# Altium project Motor Driver Board 2019-2020.PrjPcb (part 2 of 3)

## Sheet MCU and Digital Interfaces.SchDoc: MCU and Digital Interfaces
size B; CompanyName: Uoe Racing; Organization: UOE Racing; Address1: University of Ottawa; Address2: Camry M; Address3: &; Address4: Nick M; DocumentNumber: 2020; Revision: A; SheetNumber: 2; SheetTotal: 4
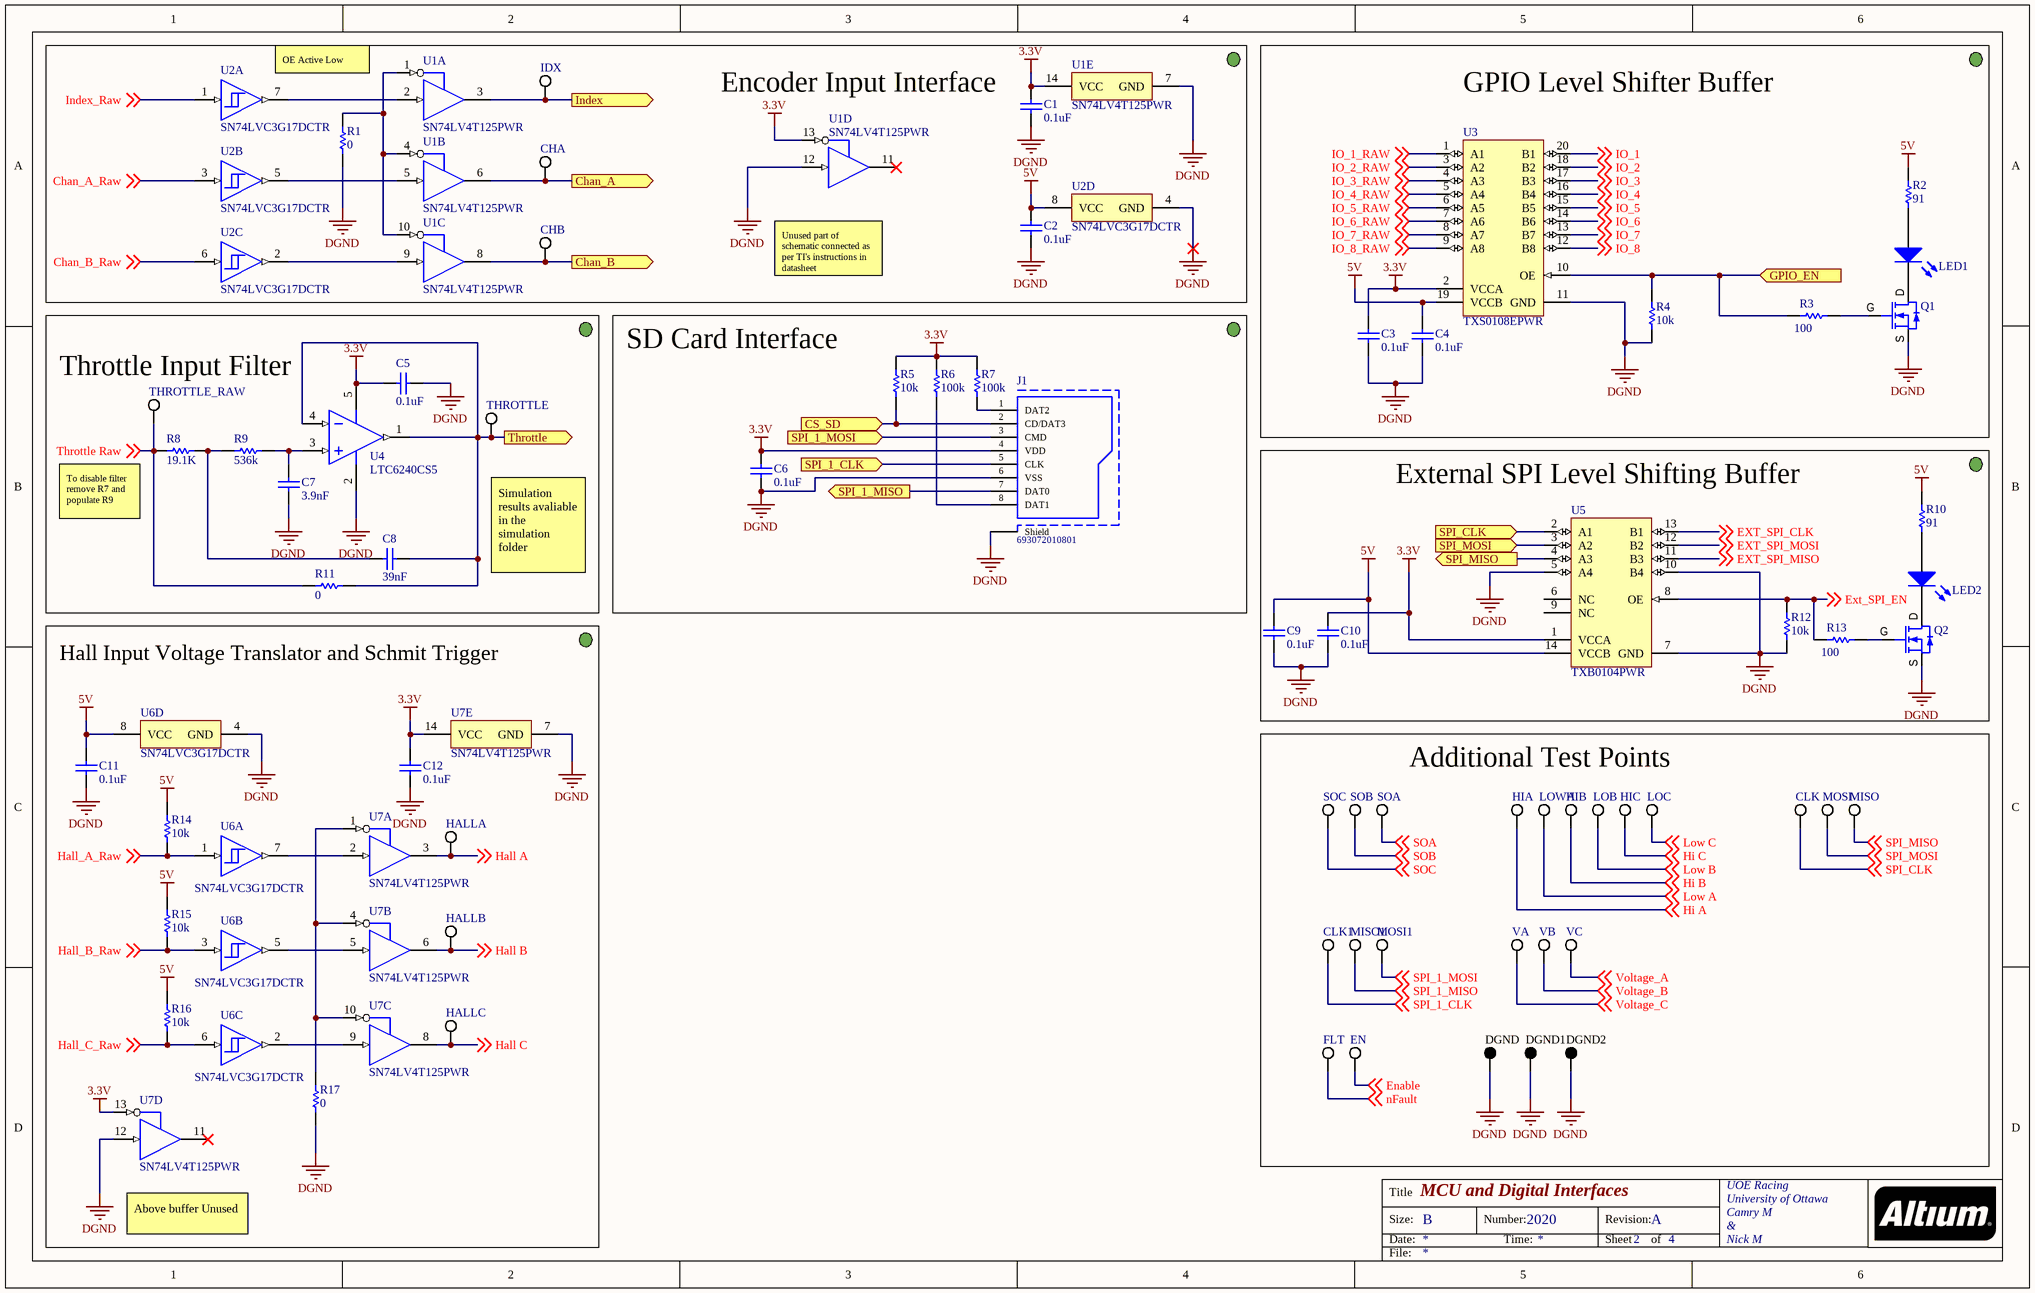
[diagram p1: MCU and Digital Interfaces.SchDoc]

### Parts
C1  0.1uF  [CAPC1608X05L]
C2  0.1uF  [CAPC1608X05L]
C3  0.1uF  [CAPC1608X05L]
C4  0.1uF  [CAPC1608X05L]
C5  0.1uF  [CAPC1608X05L]
C6  0.1uF  [CAPC1608X05L]
C7  3.9nF  [CAPC1608X05L]
C8  39nF  [CAPC1608X05L]
C9  0.1uF  [CAPC1608X05L]
C10  0.1uF  [CAPC1608X05L]
C11  0.1uF  [CAPC1608X05L]
C12  0.1uF  [CAPC1608X05L]
CHA  5015  [KSTN-5015_V]  (value not drawn)
CHB  5015  [KSTN-5015_V]  (value not drawn)
CLK  5015  [KSTN-5015_V]  (value not drawn)
CLK1  5015  [KSTN-5015_V]  (value not drawn)
DGND  5011  [KSTN-5011_V]  (value not drawn)
DGND1  5011  [KSTN-5011_V]  (value not drawn)
DGND2  5011  [KSTN-5011_V]  (value not drawn)
EN  5015  [KSTN-5015_V]  (value not drawn)
FLT  5015  [KSTN-5015_V]  (value not drawn)
HALLA  5015  [KSTN-5015_V]  (value not drawn)
HALLB  5015  [KSTN-5015_V]  (value not drawn)
HALLC  5015  [KSTN-5015_V]  (value not drawn)
HIA  5015  [KSTN-5015_V]  (value not drawn)
HIB  5015  [KSTN-5015_V]  (value not drawn)
HIC  5015  [KSTN-5015_V]  (value not drawn)
IDX  5015  [KSTN-5015_V]  (value not drawn)
J1  693072010801  [693072010801]
LED1  150080GS75000  [0805_A]  (value not drawn)
LED2  150080GS75000  [0805_A]  (value not drawn)
LOB  5015  [KSTN-5015_V]  (value not drawn)
LOC  5015  [KSTN-5015_V]  (value not drawn)
LOWA  5015  [KSTN-5015_V]  (value not drawn)
MISO  5015  [KSTN-5015_V]  (value not drawn)
MISO1  5015  [KSTN-5015_V]  (value not drawn)
MOSI  5015  [KSTN-5015_V]  (value not drawn)
MOSI1  5015  [KSTN-5015_V]  (value not drawn)
Q1  DMN1019USN-7  [SOT95P285X140-3N]  (value not drawn)
Q2  DMN1019USN-7  [SOT95P285X140-3N]  (value not drawn)
R1  0  [RESC3116X65X40NL10T20]
R2  91  [RESC1608X50X30NL20T20]
R3  100  [CAPC1608X05L]
R4  10k  [CAPC1608X05L]
R5  10k  [CAPC1608X05L]
R6  100k  [CAPC1608X05L]
R7  100k  [CAPC1608X05L]
R8  19.1K  [CAPC1608X05L]
R9  536k  [CAPC1608X05L]
R10  91  [RESC1608X50X30NL20T20]
R11  0  [RESC3116X65X40NL10T20]
R12  10k  [CAPC1608X05L]
R13  100  [CAPC1608X05L]
R14  10k  [CAPC1608X05L]
R15  10k  [CAPC1608X05L]
R16  10k  [CAPC1608X05L]
R17  0  [RESC3116X65X40NL10T20]
SOA  5015  [KSTN-5015_V]  (value not drawn)
SOB  5015  [KSTN-5015_V]  (value not drawn)
SOC  5015  [KSTN-5015_V]  (value not drawn)
THROTTLE  5015  [KSTN-5015_V]  (value not drawn)
THROTTLE_RAW  5015  [KSTN-5015_V]  (value not drawn)
U1  SN74LV4T125PWR  [PW0014A_N]  (parts A,B,C,D,E of 5)
U2  SN74LVC3G17DCTR  [DCT0008A_M]  (parts A,B,C,D of 4)
U3  TXS0108EPWR  [PW0020A_M]
U4  LTC6240CS5  [LT-S5-5-TSOT-23_L]
U5  TXB0104PWR  [PW0014A_N]
U6  SN74LVC3G17DCTR  [DCT0008A_M]  (parts A,B,C,D of 4)
U7  SN74LV4T125PWR  [PW0014A_N]  (parts A,B,C,D,E of 5)
VA  5015  [KSTN-5015_V]  (value not drawn)
VB  5015  [KSTN-5015_V]  (value not drawn)
VC  5015  [KSTN-5015_V]  (value not drawn)

### Blocks framed on the sheet
Encoder Input Interface: C1 C2 CHA CHB IDX R1 U1 U2
GPIO Level Shifter Buffer: C3 C4 LED1 Q1 R2-R4 U3
Throttle Input Filter: C5 C7 C8 R8 R9 R11 THROTTLE THROTTLE_RAW U4
SD Card Interface: C6 J1 R5-R7
External SPI Level Shifting Buffer: C9 C10 LED2 Q2 R10 R12 R13 U5
Hall Input Voltage Translator and Schmit Trigger: C11 C12 HALLA HALLB HALLC R14-R17 U6 U7
Additional Test Points: CLK CLK1 DGND DGND1 DGND2 EN FLT HIA HIB HIC LOB LOC LOWA MISO MISO1 MOSI MOSI1 SOA SOB SOC VA VB VC

### Ports
Chan_A (out), Chan_B (out), CS_SD (in), GPIO_EN (in), Index (out), SPI_1_CLK (in), SPI_1_MISO (out), SPI_1_MOSI (in), SPI_CLK (in), SPI_MISO (out), SPI_MOSI (in), Throttle (out)

### Nets
3.3V: C1.2 C3.2 C5.1 C6.2 C10.2 C12.2 J1.4(VDD) R5.2 R6.2 R7.2 U1.13(4~{OE}) U1.14(VCC) U3.2(VCCA) U4.5(V+) U5.1(VCCA) U7.13(4~{OE}) U7.14(VCC)
5V: C2.2 C4.2 C9.2 C11.2 R2.2 R10.2 R14.2 R15.2 R16.2 U2.8(VCC) U3.19(VCCB) U5.14(VCCB) U6.8(VCC)
DGND: C1.1 C2.1 C3.1 C4.1 C5.2 C6.1 C7.1 C9.1 C10.1 C11.1 C12.1 DGND.1 DGND1.1 DGND2.1 J1.6(VSS) J1.Shield Q1.S Q2.S R1.1 R4.1 R12.1 R17.1 U1.7(GND) U1.12(4A) U2.4(GND) U3.11(GND) U4.2(V-) U5.5(A4) U5.7(GND) U5.10(B4) U6.4(GND) U7.7(GND) U7.12(4A)  [project net AGND]
Chan_A_Raw: U2.3(2A) ; off-sheet Chan_A_Raw
Chan_B_Raw: U2.6(3A) ; off-sheet Chan_B_Raw
Enable: EN.1 ; off-sheet Enable
EXT_SPI_CLK: U5.13(B1) ; off-sheet EXT_SPI_CLK
Ext_SPI_EN: R12.2 R13.1 U5.8(OE) ; off-sheet Ext_SPI_EN
EXT_SPI_MISO: U5.11(B3) ; off-sheet EXT_SPI_MISO
EXT_SPI_MOSI: U5.12(B2) ; off-sheet EXT_SPI_MOSI
Hall A: HALLA.1 U7.3(1Y) ; off-sheet Hall A
Hall B: HALLB.1 U7.6(2Y) ; off-sheet Hall B
Hall C: HALLC.1 U7.8(3Y) ; off-sheet Hall C
Hall_A_Raw: R14.1 U6.1(1A) ; off-sheet Hall_A_Raw
Hall_B_Raw: R15.1 U6.3(2A) ; off-sheet Hall_B_Raw
Hall_C_Raw: R16.1 U6.6(3A) ; off-sheet Hall_C_Raw
Hi A: HIA.1 ; off-sheet Hi A
Hi B: HIB.1 ; off-sheet Hi B
Hi C: HIC.1 ; off-sheet Hi C
Index_Raw: U2.1(1A) ; off-sheet Index_Raw
IO_1: U3.20(B1) ; off-sheet IO_1
IO_1_RAW: U3.1(A1) ; off-sheet IO_1_RAW
IO_2: U3.18(B2) ; off-sheet IO_2
IO_2_RAW: U3.3(A2) ; off-sheet IO_2_RAW
IO_3: U3.17(B3) ; off-sheet IO_3
IO_3_RAW: U3.4(A3) ; off-sheet IO_3_RAW
IO_4: U3.16(B4) ; off-sheet IO_4
IO_4_RAW: U3.5(A4) ; off-sheet IO_4_RAW
IO_5: U3.15(B5) ; off-sheet IO_5
IO_5_RAW: U3.6(A5) ; off-sheet IO_5_RAW
IO_6: U3.14(B6) ; off-sheet IO_6
IO_6_RAW: U3.7(A6) ; off-sheet IO_6_RAW
IO_7: U3.13(B7) ; off-sheet IO_7
IO_7_RAW: U3.8(A7) ; off-sheet IO_7_RAW
IO_8: U3.12(B8) ; off-sheet IO_8
IO_8_RAW: U3.9(A8) ; off-sheet IO_8_RAW
Low A: LOWA.1 ; off-sheet Low A
Low B: LOB.1 ; off-sheet Low B
Low C: LOC.1 ; off-sheet Low C
nFault: FLT.1 ; off-sheet nFault
SOA: SOA.1 ; off-sheet SOA
SOB: SOB.1 ; off-sheet SOB
SOC: SOC.1 ; off-sheet SOC
SPI_1_CLK: CLK1.1 ; off-sheet SPI_1_CLK
SPI_1_MISO: MISO1.1 ; off-sheet SPI_1_MISO
SPI_1_MOSI: MOSI1.1 ; off-sheet SPI_1_MOSI
SPI_CLK: CLK.1 ; off-sheet SPI_CLK
SPI_MISO: MISO.1 ; off-sheet SPI_MISO
SPI_MOSI: MOSI.1 ; off-sheet SPI_MOSI
Throttle Raw: R8.1 R11.1 THROTTLE_RAW.1 ; off-sheet Throttle Raw
Voltage_A: VC.1 ; off-sheet Voltage_A
Voltage_B: VB.1 ; off-sheet Voltage_B
Voltage_C: VA.1 ; off-sheet Voltage_C
NetC7_2: C7.2 R9.2 U4.3(+IN)
NetC8_1: C8.1 R8.2 R9.1
NetC8_2: C8.2 R11.2 THROTTLE.1 U4.1(OUT) U4.4(-IN) ; port Throttle
NetCHA_1: CHA.1 U1.6(2Y) ; port Chan_A
NetCHB_1: CHB.1 U1.8(3Y) ; port Chan_B
NetIDX_1: IDX.1 U1.3(1Y) ; port Index
NetJ1_1: J1.1(DAT2) R7.1
NetJ1_2: J1.2(CD/DAT3) R5.1 ; port CS_SD
NetJ1_3: J1.3(CMD) ; port SPI_1_MOSI
NetJ1_5: J1.5(CLK) ; port SPI_1_CLK
NetJ1_7: J1.7(DAT0) ; port SPI_1_MISO
NetJ1_8: J1.8(DAT1) R6.1
NetLED1_1: LED1.1(K) Q1.D
NetLED1_2: LED1.2(A) R2.1
NetLED2_1: LED2.1(K) Q2.D
NetLED2_2: LED2.2(A) R10.1
NetQ1_G: Q1.G R3.2
NetQ2_G: Q2.G R13.2
NetR1_2: R1.2 U1.1(1~{OE}) U1.4(2~{OE}) U1.10(3~{OE})
NetR3_1: R3.1 R4.2 U3.10(OE) ; port GPIO_EN
NetR17_2: R17.2 U7.1(1~{OE}) U7.4(2~{OE}) U7.10(3~{OE})
NetU1_2: U1.2(1A) U2.7(1Y)
NetU1_5: U1.5(2A) U2.5(2Y)
NetU1_9: U1.9(3A) U2.2(3Y)
NetU5_2: U5.2(A1) ; port SPI_CLK
NetU5_3: U5.3(A2) ; port SPI_MOSI
NetU5_4: U5.4(A3) ; port SPI_MISO
NetU6_2: U6.2(3Y) U7.9(3A)
NetU6_5: U6.5(2Y) U7.5(2A)
NetU6_7: U6.7(1Y) U7.2(1A)

Not connected (* = marked no-connect by the designer): U1 11(4Y)*; U5 6(NC) 9(NC); U7 11(4Y)*

### Notes on the sheet
- (near U2) OE Active Low
- Unused part of schematic connected as per TI's instructions in datasheet
- (near R8) To disable filter remove R7 and populate R9
- Simulation results avaliable in the simulation folder
- Above buffer Unused
- Title
- Size:
- Date:
- B
- Number:
- Time:
- Revision:
- Sheet
- of
- File:

### Library data of the parts
C1-C6 C9-C12 = CC0603JRX7R9BB104: Cap Ceramic 0.1uF 50V X7R 5% SMD 0603 125C Paper T/R; Manufacturer: Yageo; Capacitance: 100nF; Supplier 1: Digi-Key; Manufacturer Part Number: CC0603JRX7R9BB104; Stock 1: 40000; Pricing 1: 1=0.17, 10=0.12, 100=0.0562, 500=0.03942, 1000=0.03263 (USD); Mount: Surface Mount; Case/Package: 0603; Number of Pins: 2; Weight: 7.1E-05oz; Case Code (Imperial): 0603; Case Code (Metric): 1608; Min Operating Temperature: -55°C; Max Operating Temperature: 125°C; Tolerance: 5%; Dielectric: X7R; Voltage Rating: 50V; Packaging: Tape and Reel; Voltage Rating (DC): 50V; Termination: SMD/SMT; Composition: Ceramic; Length: 1.6mm; Height: 0.8mm; Width: 0.031inch; Thickness: 0.035inch; Depth: 0.8mm; Radiation Hardening: No; Lead Free: Lead Free; Halogen Free: Halogen Free; ComponentLink1URL: http://www.yageo.com/documents/recent/UPY-GPHC_X7R_6.3V-to-50V_8.pdf; ComponentLink1Description: http://www.yageo.com/documents/recent/UPY-GPHC_X7R_6.3V-to-50V_8.pdf
  C1 C2: ClassName: Encoder
  C5: ClassName: Throttle
C7 = C0603C392J5RACTU: Multilayer Ceramic Capacitors MLCC - SMD/SMT 50volts 3900pF X7R 5%; Manufacturer 1: KEMET; Voltage Rating (DC): 50V; Dissipation Factor: 2.5%; Supplier 1: Digi-Key; Manufacturer Part Number 1: C0603C392J5RACTU; Stock 1: 9639; Pricing 1: 1=0.40000, 10=0.28100, 100=0.16840, 500=0.12628, 1000=0.10663 (USD); RoHS: Yes; Mount: Surface Mount; Case/Package: 0603; Dielectric Material: Ceramic; Case Code (Metric): 1608; Case Code (Imperial): 0603; Min Operating Temperature: -55°C; Max Operating Temperature: 125°C; Capacitance: 3.9nF; Tolerance: 5%; Packaging: Tape and Reel; Dielectric: X7R; Voltage Rating: 50V; Package Quantity: 1; Termination: SMD/SMT; Length: 1.6mm; Height: 0.8mm; Depth: 0.8mm; Width: 0.031inch; Thickness: 0.034inch; Lead Pitch: 0.7mm; REACH SVHC: No SVHC; ComponentLink1URL: http://components.arrow.com/part/dataview/2089105S5980753N7429?src-supplier=Arrow; ComponentLink1Description: http://components.arrow.com/part/dataview/2089105S5980753N7429?src-supplier=Arrow; ComponentLink2URL: http://www.mouser.com/ds/2/212/KEM_C1002_X7R_SMD-1102033.pdf?src-supplier=Mouser; ComponentLink2Description: http://www.mouser.com/ds/2/212/KEM_C1002_X7R_SMD-1102033.pdf?src-supplier=Mouser; ComponentLink3URL: https://search.kemet.com/component-edge/download/datasheet/C0603C392J5RACTU.pdf?src-supplier=Digi-Key; ComponentLink3Description: https://search.kemet.com/component-edge/download/datasheet/C0603C392J5RACTU.pdf?src-supplier=Digi-Key; ComponentLink4URL: https://api.kemet.com/component-edge/download/datasheet/C0603C392J5RACTU.pdf?src-supplier=Digi-Key; ComponentLink4Description: https://api.kemet.com/component-edge/download/datasheet/C0603C392J5RACTU.pdf?src-supplier=Digi-Key; ClassName: Throttle
C8 = 06035C393JAT2A: Ceramic Capacitor 0.039uf 50v, X7r, 5%, 0603, Full Reel; Manufacturer 1: Kyocera AVX; Dissipation Factor: 2.5%; Supplier 1: Digi-Key; Manufacturer Part Number 1: 06035C393JAT2A; Stock 1: 3075; Pricing 1: 1=0.37000, 10=0.25900, 100=0.15560, 500=0.11670, 1000=0.09854 (USD); RoHS: Yes; Mount: Surface Mount; Case/Package: 0603; Number of Pins: 2; Case Code (Imperial): 0603; Case Code (Metric): 1608; Min Operating Temperature: -55°C; Max Operating Temperature: 125°C; Capacitance: 39nF; Package Quantity: 4000; Voltage Rating: 50V; Voltage Rating (DC): 50V; Tolerance: 5%; Packaging: Tape and Reel; Dielectric: X7R; Termination: SMD/SMT; Length: 1.6mm; Width: 0.81mm; Thickness: 0.035inch; Depth: 0.81mm; Radiation Hardening: No; REACH SVHC: Unknown; ComponentLink1URL: https://datasheet.ciiva.com/208/cx7r-208430.pdf?src-supplier=Digi-Key; ComponentLink1Description: https://datasheet.ciiva.com/208/cx7r-208430.pdf?src-supplier=Digi-Key; ClassName: Throttle
CHA CHB CLK CLK1 EN FLT HALLA HALLB HALLC HIA HIB HIC IDX LOB LOC LOWA MISO MISO1 MOSI MOSI1 SOA SOB SOC THROTTLE THROTTLE_RAW VA VB VC = CMP-2000-05183-1: Test Point, White, SMT; Manufacturer: Keystone; Primary Type: PCBTestPoints; Style: Miniature; Finish Plating: SilverPlate; Material, Contact: PhosphorBronze; Material: PhosphorBronze; Datasheet URL: https://datasheet.ciiva.com/1123/5015-1123862.pdf; Thickness: 0.010In.; Manufacturer URL: http://www.keyelco.com/; Length: 0.105"(2.667mm); Datasheet Version: Mar-14; Contact Plating: Silver; Mounting Type: SurfaceMount; Termination: SMT; Type: TestPointsonTapeandReel; Height: 0.06In.; Mounting: SurfaceMount
  CHA CHB IDX: ClassName: Encoder
  THROTTLE THROTTLE_RAW: ClassName: Throttle
DGND DGND1 DGND2 = CMP-1672-00003-4: Test Point, Black, Through Hole, RoHS, Bulk; Manufacturer: Keystone; ComponentLink2URL: http://www.keyelco.com/product-pdf.cfm?p=1320; Colour: Black; Pins: 1; REACH SVHC: No SVHC; ComponentLink1URL: http://www.keyelco.com/; PackageReference: 5011; Contact Plating: Silver; Package Quantity: 100; Packaging: Bulk; RoHSCompliant: true; Height: 8.12 mm; PackageDescription: 1-Pin Through Hole Device, Dia 3.17 mm; Mount: Through Hole; Mounting Technology: Through Hole; DatasheetVersion: Rev. F, 12/2013; ComponentLink1Description: Manufacturer URL; Contact Material: Bronze; ComponentLink2Description: Datasheet; ClassName: 5V Regulator
J1 = CMP-1502-00164-1: WR-CRD Micro SD Card Connector, Hinge Type; Manufacturer: Wurth Elektronik; Withstanding Voltage: 500VAC; Rated Current: 0.5A; Working Voltage: 100VAC; Datasheet URL: https://katalog.we-online.de/em/datasheet/693072010801.pdf; Part Number: 693072010801; Publisher: WurthElektronik; Manufacturer URL: http://www.we-online.de; Mounting Technology: SMT; Package Reference: 693072010801; Packaging: TapeandReel; Operating Temperature: -25to85degC
LED1 LED2 = CMP-1426-00007-1: SMD mono-color Chip LED, WL-SMCW, Green; Manufacturer: Wuerth Elektronik; PackageReference: 0805_A; Color: Green; PartNumber: 150080GS75000; ComponentLink2URL: http://katalog.we-online.com/led/datasheet/150080GS75000.pdf; ComponentLink1URL: http://www.we-online.com; ComponentLink1Description: Manufacturer URL; ComponentLink2Description: Datasheet
Q1 Q2 = DMN1019USN-7: MOSFET N-CH 12V 9.3A SC59; Manufacturer 1: Diodes; Capacitance: 2.426E-09F; Rds On Max: 10mR; Input Capacitance: 2.426nF; Max Power Dissipation: 680mW; Element Configuration: Single; Number of Channels: 1; Drain to Source Resistance: 41mR; Gate to Source Voltage (Vgs): 4.5V; Fall Time: 16.8ns; Rise Time: 57.6ns; Turn-Off Delay Time: 22.2ns; Turn-On Delay Time: 7.6ns; Supplier 1: Digi-Key; Manufacturer Part Number 1: DMN1019USN-7; Stock 1: 30621; Pricing 1: 1=0.44000, 10=0.35400, 100=0.24130, 500=0.18096, 1000=0.13572 (USD); RoHS: Yes; Mount: Surface Mount; Case/Package: TO-236-3; Weight: 0.000282oz; Min Operating Temperature: -55°C; Max Operating Temperature: 150°C; Packaging: Tape and Reel; Drain to Source Voltage (Vdss): 12V; Continuous Drain Current (ID): 9.3A; Drain to Source Breakdown Voltage: 12V; Package Quantity: 3000; Lead Free: Lead Free; ComponentLink1URL: http://www.mouser.com/ds/2/115/DMN1019USN-336718.pdf?src-supplier=Mouser; ComponentLink1Description: http://www.mouser.com/ds/2/115/DMN1019USN-336718.pdf?src-supplier=Mouser; ComponentLink2URL: https://www.diodes.com/assets/Datasheets/DMN1019USN.pdf?src-supplier=Digi-Key; ComponentLink2Description: https://www.diodes.com/assets/Datasheets/DMN1019USN.pdf?src-supplier=Digi-Key
R1 R11 R17 = CMP-2100-03681-1: Chip Resistor, 0 Ohm, +/- 5%, -55 to 155 degC, 1206 (3216 Metric), RoHS, Tape and Reel; Manufacturer: Yageo; Max Power Dissipation: 250mW; Resistance: 0mOhm; Voltage Rating: 200V; Temperature Coefficient: 200ppm/degreesC; Case Code (Imperial): 1206; Lead Free: LeadFree; Package Quantity: 5000; Radiation Hardening: No; Tolerance: 5%; Length: 3.1mm; Termination: SMD/SMT; Contact Plating: Tin; Military Standard: Not; Manufacturer URL: http://www.yageo.com/; Datasheet URL: http://www.yageo.com/documents/recent/PYu-RC_Group_51_RoHS_L_5.pdf; Height: 0.026inch; RoHSCompliant: true; Min Operating Temperature: -55degC; REACH SVHC: Unknown; Max Operating Temperature: 155degC; Depth: 1.6mm; Packaging: TapeandReel; Package Reference: 1206.0; Number of Terminations: 2; Case/Package: 1206; Composition: CarbonFilm; Case Code (Metric): 3216; Datasheet Version: Rev. 5, 10/2016; Power Rating: 250mW; Package Description: 2-Pin Surface Mount Device, Body 3.1 x 1.6 mm; Width: 0.063inch
  R1: ClassName: Encoder
  R11: ClassName: Throttle
R2 R10 = CMP-2000-01951-1: Part Number: RG1608N-910-B-T5; Manufacturer: Susumu
R3 R13 = RR0816P-101-D: RES SMD 100 OHM 0.5% 1/16W 0816; Manufacturer: Susumu; Resistance: 100R; Power Rating: 63mW; Voltage Rating: 75V; Temperature Coefficient: 25ppm/°C; Supplier 1: Digi-Key; Manufacturer Part Number: RR0816P-101-D; RoHS: Yes; Stock 1: 167672; Pricing 1: 1 = 0.11000, 10 = 0.09800, 100 = 0.03760, 1000 = 0.01654, 2500 = 0.01428 (USD); Case/Package: 0603; Number of Pins: 2; Weight: 7.1E-05oz; Case Code (Metric): 1608; Case Code (Imperial): 0603; Min Operating Temperature: -55°C; Max Operating Temperature: 125°C; Package Quantity: 1; Tolerance: 0.5%; Packaging: Cut Tape; Composition: Thin Film; Number of Terminations: 2; Termination: SMD/SMT; Max Power Dissipation: 63mW; Voltage Rating (DC): 75V; Length: 1.6mm; Height: 0.4mm; Width: 0.031inch; Depth: 0.8mm; REACH SVHC: Unknown; Lead Free: Lead Free; ComponentLink1URL: http://www.susumu.co.jp/common/pdf/n_catalog_partition05_en.pdf; ComponentLink1Description: http://www.susumu.co.jp/common/pdf/n_catalog_partition05_en.pdf; ComponentLink2URL: http://documents.rs-components.com/techlib://itc_doclist_GB.htm?stockno=3915191; ComponentLink2Description: http://documents.rs-components.com/techlib://itc_doclist_GB.htm?stockno=3915191
R4 R5 R12 R14-R16 = RR0816P-103-D: RES SMD 10K OHM 0.5% 1/16W 0816; Manufacturer: Susumu; Resistance: 10kR; Power Rating: 63mW; Voltage Rating: 75V; Temperature Coefficient: 25ppm/°C; Supplier 1: Digi-Key; Manufacturer Part Number: RR0816P-103-D; Stock 1: 1031099; Pricing 1: 1=0.11, 10=0.098, 100=0.0376, 1000=0.01654, 2500=0.01428 (USD); Case/Package: 0603; Number of Pins: 2; Weight: 7.1E-05oz; Case Code (Imperial): 0603; Case Code (Metric): 1608; Min Operating Temperature: -55°C; Max Operating Temperature: 125°C; Packaging: Tape and Reel; Tolerance: 0.5%; Package Quantity: 1; Termination: SMD/SMT; Composition: Thin Film; Number of Terminations: 2; Max Power Dissipation: 63mW; Voltage Rating (DC): 75V; Length: 1.6mm; Height: 0.4mm; Width: 0.8mm; Depth: 0.8mm; REACH SVHC: Unknown; Lead Free: Lead Free; ComponentLink1URL: http://documents.rs-components.com/techlib://itc_doclist_GB.htm?stockno=3915321; ComponentLink1Description: http://documents.rs-components.com/techlib://itc_doclist_GB.htm?stockno=3915321; ComponentLink2URL: http://www.susumu.co.jp/common/pdf/n_catalog_partition05_en.pdf; ComponentLink2Description: http://www.susumu.co.jp/common/pdf/n_catalog_partition05_en.pdf
R6 R7 = CR0603-JW-104ELF: BOURNS - CR0603-JW-104ELF - RES, 100K, 5%, 0.1W, 0603, THICK FILM; Resistance: 100kR; Power Rating: 100mW; Voltage Rating: 50V; Temperature Coefficient: 200ppm/°C; Supplier 1: Digi-Key; Manufacturer 1: Bourns; Manufacturer Part Number 1: CR0603-JW-104ELF; Stock 1: 49390; Pricing 1: 1=0.10000, 10=0.01500, 25=0.01080, 50=0.00840, 100=0.00610, 250=0.00468, 500=0.00374, 1000=0.00275 (USD); RoHS: Yes; Mount: Surface Mount; Case/Package: 0603; Number of Pins: 2; Case Code (Imperial): 0603; Case Code (Metric): 1608; Contact Plating: Tin; Min Operating Temperature: -55°C; Max Operating Temperature: 155°C; Packaging: Tape and Reel; Tolerance: 5%; Package Quantity: 5000; Composition: Thick Film; Termination: SMD/SMT; Working Voltage: 50V; Military Standard: Not; Voltage Rating (DC): 50V; Length: 1.6mm; Height: 0.45mm; Width: 0.8mm; Depth: 0.8mm; Thickness: 457um; Radiation Hardening: No; REACH SVHC: No SVHC; ComponentLink1URL: https://datasheet.ciiva.com/22713/691949-22713239.pdf?src-supplier=Element14; ComponentLink1Description: https://datasheet.ciiva.com/22713/691949-22713239.pdf?src-supplier=Element14; ComponentLink2URL: https://datasheet.ciiva.com/23776/1902866-23776391.pdf?src-supplier=Newark; ComponentLink2Description: https://datasheet.ciiva.com/23776/1902866-23776391.pdf?src-supplier=Newark; ComponentLink3URL: https://datasheet.ciiva.com/16766/70154685-16766760.pdf?src-supplier=Allied+Electronics; ComponentLink3Description: https://datasheet.ciiva.com/16766/70154685-16766760.pdf?src-supplier=Allied+Electronics; ComponentLink4URL: https://datasheet.ciiva.com/9120/chpreztr-9120764.pdf?src-supplier=Avnet; ComponentLink4Description: https://datasheet.ciiva.com/9120/chpreztr-9120764.pdf?src-supplier=Avnet; ComponentLink5URL: https://datasheet.ciiva.com/46383/1791942-46383790.pdf?src-supplier=Element14; ComponentLink5Description: https://datasheet.ciiva.com/46383/1791942-46383790.pdf?src-supplier=Element14; ComponentLink6URL: https://datasheet.ciiva.com/30229/159chpreztr-30229129.pdf?src-supplier=Onlinecomponents.com; ComponentLink6Description: https://datasheet.ciiva.com/30229/159chpreztr-30229129.pdf?src-supplier=Onlinecomponents.com; ComponentLink7URL: https://datasheet.ciiva.com/16935/chpreztr-16935963.pdf?src-supplier=Avnet+Europe; ComponentLink7Description: https://datasheet.ciiva.com/16935/chpreztr-16935963.pdf?src-supplier=Avnet+Europe; ComponentLink8URL: https://datasheet.ciiva.com/5543/chpreztr-5543676.pdf?src-supplier=Mouser; ComponentLink8Description: https://datasheet.ciiva.com/5543/chpreztr-5543676.pdf?src-supplier=Mouser; ComponentLink9URL: https://datasheet.ciiva.com/48692/001055501-da-01-en-smd-wid-cr0603-jw-104elf-100k-ohm-1-10w-48692133.pdf?src-supplier=Conrad; ComponentLink9Description: https://datasheet.ciiva.com/48692/001055501-da-01-en-smd-wid-cr0603-jw-104elf-100k-ohm-1-10w-48692133.pdf?src-supplier=Conrad
R8 = CR0603-FX-1912ELF: RES SMD 19.1K OHM 1% 1/10W 0603; Manufacturer 1: Bourns; Resistance: 19.1kR; Power Rating: 100mW; Voltage Rating: 50V; Temperature Coefficient: 100ppm/°C; Supplier 1: Digi-Key; Manufacturer Part Number 1: CR0603-FX-1912ELF; Stock 1: 78916; Pricing 1: 1=0.10000, 10=0.02000, 100=0.00820, 1000=0.00367, 2500=0.00319 (USD); RoHS: Yes; Mount: Surface Mount; Case/Package: 0603; Case Code (Metric): 1608; Case Code (Imperial): 0603; Contact Plating: Tin; Min Operating Temperature: -55°C; Max Operating Temperature: 155°C; Package Quantity: 5000; Packaging: Tape and Reel; Tolerance: 1%; Composition: Thick Film; Number of Terminations: 2; Termination: SMD/SMT; Military Standard: Not; Max Power Dissipation: 100mW; Features: Moisture Resistant; Length: 1.6mm; Height: 0.022inch; Width: 0.031inch; Depth: 0.8mm; Thickness: 457um; Radiation Hardening: No; ComponentLink1URL: https://datasheet.ciiva.com/5549/chpreztr-5549702.pdf?src-supplier=Mouser; ComponentLink1Description: https://datasheet.ciiva.com/5549/chpreztr-5549702.pdf?src-supplier=Mouser; ComponentLink2URL: https://datasheet.ciiva.com/9121/chpreztr-9121960.pdf?src-supplier=Avnet; ComponentLink2Description: https://datasheet.ciiva.com/9121/chpreztr-9121960.pdf?src-supplier=Avnet; ClassName: Throttle
R9 = RC0603FR-07536KL: RES SMD 536K OHM 1% 1/10W 0603; Manufacturer 1: Yageo; Resistance: 536kR; Temperature Coefficient: 100ppm/°C; Power Rating: 100mW; Voltage Rating: 50V; Supplier 1: Digi-Key; Manufacturer Part Number 1: RC0603FR-07536KL; Stock 1: 45136; Pricing 1: 1=0.10000, 10=0.02400, 100=0.00970, 1000=0.00437, 2500=0.00379 (USD); RoHS: Yes; Case/Package: 0603; Contact Plating: Tin,Matte; Case Code (Imperial): 0603; Case Code (Metric): 1608; Min Operating Temperature: -55°C; Max Operating Temperature: 155°C; Tolerance: 1%; Composition: Thick Film; Packaging: Tape and Reel; Termination: SMD/SMT; Voltage Rating (DC): 50V; Length: 1.6mm; Height: 0.45mm; Width: 0.8mm; Lead Free: Lead Free; ComponentLink1URL: https://datasheet.ciiva.com/8885/pyu-rc0603-51-rohs-l-4-8885383.pdf?src-supplier=Avnet; ComponentLink1Description: https://datasheet.ciiva.com/8885/pyu-rc0603-51-rohs-l-4-8885383.pdf?src-supplier=Avnet; ComponentLink2URL: https://datasheet.ciiva.com/12558/rc0603-272842-12558314.pdf?src-supplier=Mouser; ComponentLink2Description: https://datasheet.ciiva.com/12558/rc0603-272842-12558314.pdf?src-supplier=Mouser; ComponentLink3URL: https://datasheet.ciiva.com/28389/pyu-rc0603-51-rohs-l-4-28389818.pdf?src-supplier=Avnet+Europe; ComponentLink3Description: https://datasheet.ciiva.com/28389/pyu-rc0603-51-rohs-l-4-28389818.pdf?src-supplier=Avnet+Europe; ClassName: Throttle
U1 U7 = CMP-0859-00971-3: Single Power Supply Quadruple Buffer GATE w/ 3-State Output CMOS Logic Level Shifter, PW0014A, LARGE T&R; Manufacturer: Texas Instruments; Bits(#): 4; VCC(Min)(V): 1.6; Logic: True; 3-State Output: Yes; Voltage(Nom)(V): 1.8,2.5,3.3,5; VCC(Max)(V): 5.5; Output Drive (IOL/IOH)(Max)(mA): 16/-16; Technology Family: LV-A; F @ Nom Voltage(Max)(Mhz): 50; Schmitt Trigger: No; tpd @ Nom Voltage(Max)(ns): 12,7,5.5,3.5; ICC @ Nom Voltage(Max)(mA): 0.02; Input Type: CMOS/TTL; Sub-Family: Single Supply Translator; Rating: Catalog; Output Type: CMOS; Generic Part Number: SN74LV4T125; PackageReference: PW0014A; DatasheetVersion: SCLS749B; Operating Temperature Range(C): -40 to 125
  U1: ClassName: Encoder
U2 U6 = CMP-0859-00525-4: TRIPLE SCHMITT-TRIGGER BUFFER, DCT0008A, LARGE T&R; Manufacturer: Texas Instruments; Input Type: CMOS/TTL; Voltage(Nom)(V): 1.8,2.5,3.3,5; Sub-Family: Non-Inverting Buffer/Driver; ICC @ Nom Voltage(Max)(mA): 0.01; Output Drive (IOL/IOH)(Max)(mA): 32/-32; Rating: Catalog; VCC(Max)(V): 5.5; Output Type: CMOS; 3-State Output: No; tpd @ Nom Voltage(Max)(ns): 9.2,6.2,5.4,4.1; F @ Nom Voltage(Max)(Mhz): 150; Technology Family: LVC; Schmitt Trigger: Yes; Bits(#): 3; Logic: True; VCC(Min)(V): 1.65; PackageReference: DCT0008A; Operating Temperature Range(C): -40 to 125,-40 to 85; DatasheetVersion: SCES470E; Generic Part Number: SN74LVC3G17
  U2: ClassName: Encoder
U3 = CMP-2000-04956-1: Bidirectional Voltage-Level Translator for Open-Drain and Push-Pull Application, 8 bit, 1.2 to 3.6 V, -40 to 85 degC, 20-Pin TSSOP, Green (RoHS & no Sb/Br), Tape and Reel; Manufacturer: Texas Instruments; Logic Type: VoltageLevelTranslator; Output Current: 620µA; Propagation Delay: 4.8ns; Supply Voltage Min: 1.2V; No. of Inputs: 8; Supply Voltage Max: 5.5V; SVHC: NoSVHC(16-Jun-2014); No. of Pins: 20; Datasheet URL: https://datasheet.ciiva.com/14287/txs0108e-14287280.pdf; Operating Temperature Min: -40degC; Logic Case Style: TSSOP; Packaging: CutTape; Datasheet Version: Rev. B, 09/2008; MSL: MSL1-Unlimited; Manufacturer URL: http://www.ti.com/; Operating Temperature Max: 85degC
U4 = CMP-0359-01946-2: Single Channel, Low Noise, CMOS Operational Amplifier, RRO, 18 MHz Typical GBW, 10 V/us Typical SR, 2.8 to 6 V, 5-Pin SOT23 (S5-5), Commercial, Pb-Free, Mini Reel; PartNumber: LTC6240CS5#TRMPBF; Manufacturer: Linear Technology; Vos (mV) Typical: 0.04; Vs Max (V): 6; Vs Min (V): 2.8; Channels (#): 1; GBW (MHz) Typical: 18; SR (V/us) Typical: 10; Is (mA) Typical: 2; RevisionNote: URLs updated; ComponentLink2URL: http://cds.linear.com/docs/en/datasheet/624012fe.pdf; ComponentLink1Description: Manufacturer URL; Type: VFB; ComponentLink2Description: Datasheet; ComponentLink1URL: http://www.linear.com/; PackageDescription: 5-Lead Plastic TSOT-23, Body 1.63 x 2.90 mm, Pitch 0.95 mm; PackageReference: LT-S5-5-TSOT-23; ComponentLink3Description: Package Specification; Packing: Mini Reel; Linear Technology Part Number: LTC6240; ComponentLink3URL: http://cds.linear.com/docs/en/packaging/SOT_5_05-08-1635.pdf; DatasheetVersion: Rev. E; Mounting Technology: Surface Mount; RoHS: Pb-Free; Code_JEDEC: MO-193; ClassName: Throttle
U5 = CMP-2000-07335-1: 4-Bit Bidirectional Voltage-Level Translator with Automatic Direction Sensing and +/- 15-kV ESD Protection, -40 to 85 degC, 14-Pin TSSOP (PW), Green (RoHS & Sb/Br), Tape and Reel; Manufacturer: Texas Instruments; Dynamic Catalog: TXBSeries; Number of Bits: 4; Voltage - Supply: 1.2V~3.6V,1.65V~5.5V; Other Names: 296-21929-6; Propagation Delay (Max): 4ns; Logic Function: Translator,Bidirectional; Data Rate: 100Mbps; Differential - Input: Output:No/No; Number of Outputs/Channel: 1; Output Type: Logic; Product Training Modules: VoltageLevelTranslation; Number of Channels: 4; Package Reference: PW14; Package Description: 14-Pin Thin Shrink Small Outline Package, Body 5 x 4.4 mm, Pitch 0.65 mm; Datasheet Version: Rev. G, 11/2014; Manufacturer URL: http://www.ti.com/; Series: -; Packaging: Digi-Reel®; Mounting Technology: SurfaceMount; Family: Logic-Translators; Standard Package: 1; Category: IntegratedCircuits(ICs); Supplier Device Package: 14-TSSOP; Datasheet URL: http://www.ti.com/general/docs/lit/getliterature.tsp?genericPartNumber=TXB0104&fileType=pdf; Operating Temperature: -40°C~85°C; Input Type: Logic; Package / Case: 14-TSSOP(0.173",4.40mmWidth)